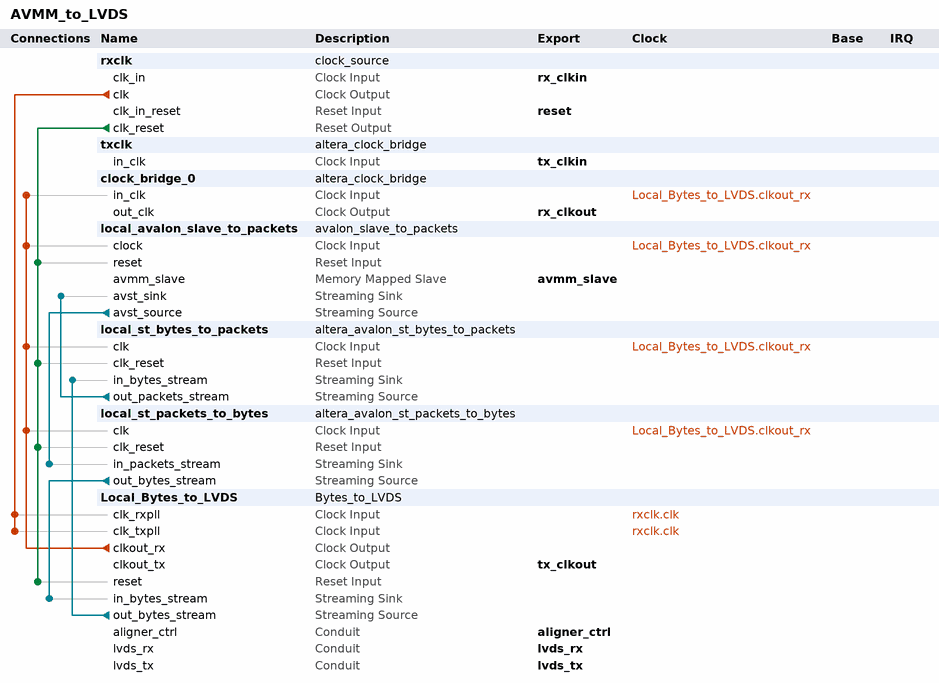
[diagram p0: system contents]
# Platform Designer (Qsys) system AVMM_to_LVDS, Cyclone V 5CSXFC6D6F31C7
# Parameters at their usual value, and those the tool derives, are not listed.
package require -exact qsys 15.0
create_system AVMM_to_LVDS
set_project_property DEVICE_FAMILY {Cyclone V}
set_project_property DEVICE 5CSXFC6D6F31C7

add_instance rxclk clock_source 15.0
set_instance_parameter_value rxclk clockFrequency 50000000

add_instance txclk altera_clock_bridge 15.0
set_instance_parameter_value txclk DERIVED_CLOCK_RATE 0
set_instance_parameter_value txclk EXPLICIT_CLOCK_RATE 0

add_instance clock_bridge_0 altera_clock_bridge 15.0
set_instance_parameter_value clock_bridge_0 DERIVED_CLOCK_RATE 0
set_instance_parameter_value clock_bridge_0 EXPLICIT_CLOCK_RATE 0

add_instance local_avalon_slave_to_packets avalon_slave_to_packets 1.0
set_instance_parameter_value local_avalon_slave_to_packets P_AWIDTH 13
set_instance_parameter_value local_avalon_slave_to_packets P_MAXBURSTSTRING 1

add_instance local_st_bytes_to_packets altera_avalon_st_bytes_to_packets 15.0
set_instance_parameter_value local_st_bytes_to_packets CHANNEL_WIDTH 8
set_instance_parameter_value local_st_bytes_to_packets ENCODING 0

add_instance local_st_packets_to_bytes altera_avalon_st_packets_to_bytes 15.0
set_instance_parameter_value local_st_packets_to_bytes CHANNEL_WIDTH 8
set_instance_parameter_value local_st_packets_to_bytes ENCODING 0

add_instance Local_Bytes_to_LVDS Bytes_to_LVDS 1.0
set_instance_parameter_value Local_Bytes_to_LVDS PT_PCFIFO false
set_instance_parameter_value Local_Bytes_to_LVDS PT_SLAVE false
set_instance_parameter_value Local_Bytes_to_LVDS P_ALIGNSEQ0 42
set_instance_parameter_value Local_Bytes_to_LVDS P_ALIGNSEQ1 42
set_instance_parameter_value Local_Bytes_to_LVDS P_DEV_FAMILY 1
set_instance_parameter_value Local_Bytes_to_LVDS P_OOSCNTR 8
set_instance_parameter_value Local_Bytes_to_LVDS P_SLAVE 0

# connections
add_connection Local_Bytes_to_LVDS.clkout_rx clock_bridge_0.in_clk clock
add_connection Local_Bytes_to_LVDS.clkout_rx local_avalon_slave_to_packets.clock clock
add_connection Local_Bytes_to_LVDS.clkout_rx local_st_bytes_to_packets.clk clock
add_connection Local_Bytes_to_LVDS.clkout_rx local_st_packets_to_bytes.clk clock
add_connection rxclk.clk Local_Bytes_to_LVDS.clk_rxpll clock
add_connection rxclk.clk Local_Bytes_to_LVDS.clk_txpll clock
add_connection rxclk.clk_reset local_avalon_slave_to_packets.reset reset
add_connection rxclk.clk_reset Local_Bytes_to_LVDS.reset reset
add_connection rxclk.clk_reset local_st_bytes_to_packets.clk_reset reset
add_connection rxclk.clk_reset local_st_packets_to_bytes.clk_reset reset
add_connection local_avalon_slave_to_packets.avst_source local_st_packets_to_bytes.in_packets_stream avalon_streaming
add_connection Local_Bytes_to_LVDS.out_bytes_stream local_st_bytes_to_packets.in_bytes_stream avalon_streaming
add_connection local_st_bytes_to_packets.out_packets_stream local_avalon_slave_to_packets.avst_sink avalon_streaming
add_connection local_st_packets_to_bytes.out_bytes_stream Local_Bytes_to_LVDS.in_bytes_stream avalon_streaming

# exported interfaces
add_interface aligner_ctrl conduit end
set_interface_property aligner_ctrl EXPORT_OF Local_Bytes_to_LVDS.aligner_ctrl
add_interface avmm_slave avalon slave
set_interface_property avmm_slave EXPORT_OF local_avalon_slave_to_packets.avmm_slave
add_interface lvds_rx conduit end
set_interface_property lvds_rx EXPORT_OF Local_Bytes_to_LVDS.lvds_rx
add_interface lvds_tx conduit end
set_interface_property lvds_tx EXPORT_OF Local_Bytes_to_LVDS.lvds_tx
add_interface reset reset sink
set_interface_property reset EXPORT_OF rxclk.clk_in_reset
add_interface rx_clkin clock sink
set_interface_property rx_clkin EXPORT_OF rxclk.clk_in
add_interface rx_clkout clock source
set_interface_property rx_clkout EXPORT_OF clock_bridge_0.out_clk
add_interface tx_clkin clock sink
set_interface_property tx_clkin EXPORT_OF txclk.in_clk
add_interface tx_clkout clock source
set_interface_property tx_clkout EXPORT_OF Local_Bytes_to_LVDS.clkout_tx

set_interconnect_requirement {$system} qsys_mm.clockCrossingAdapter HANDSHAKE
set_interconnect_requirement {$system} qsys_mm.insertDefaultSlave FALSE
set_interconnect_requirement {$system} qsys_mm.maxAdditionalLatency 1

save_system AVMM_to_LVDS.qsys
